# Altium schematic sheet SuperPower.SchDoc
size A4; Organization: Altium Limited; Address1: L3, 12a Rodborough Rd; Address2: Frenchs Forest; Address3: NSW; Address4: Australia 2086
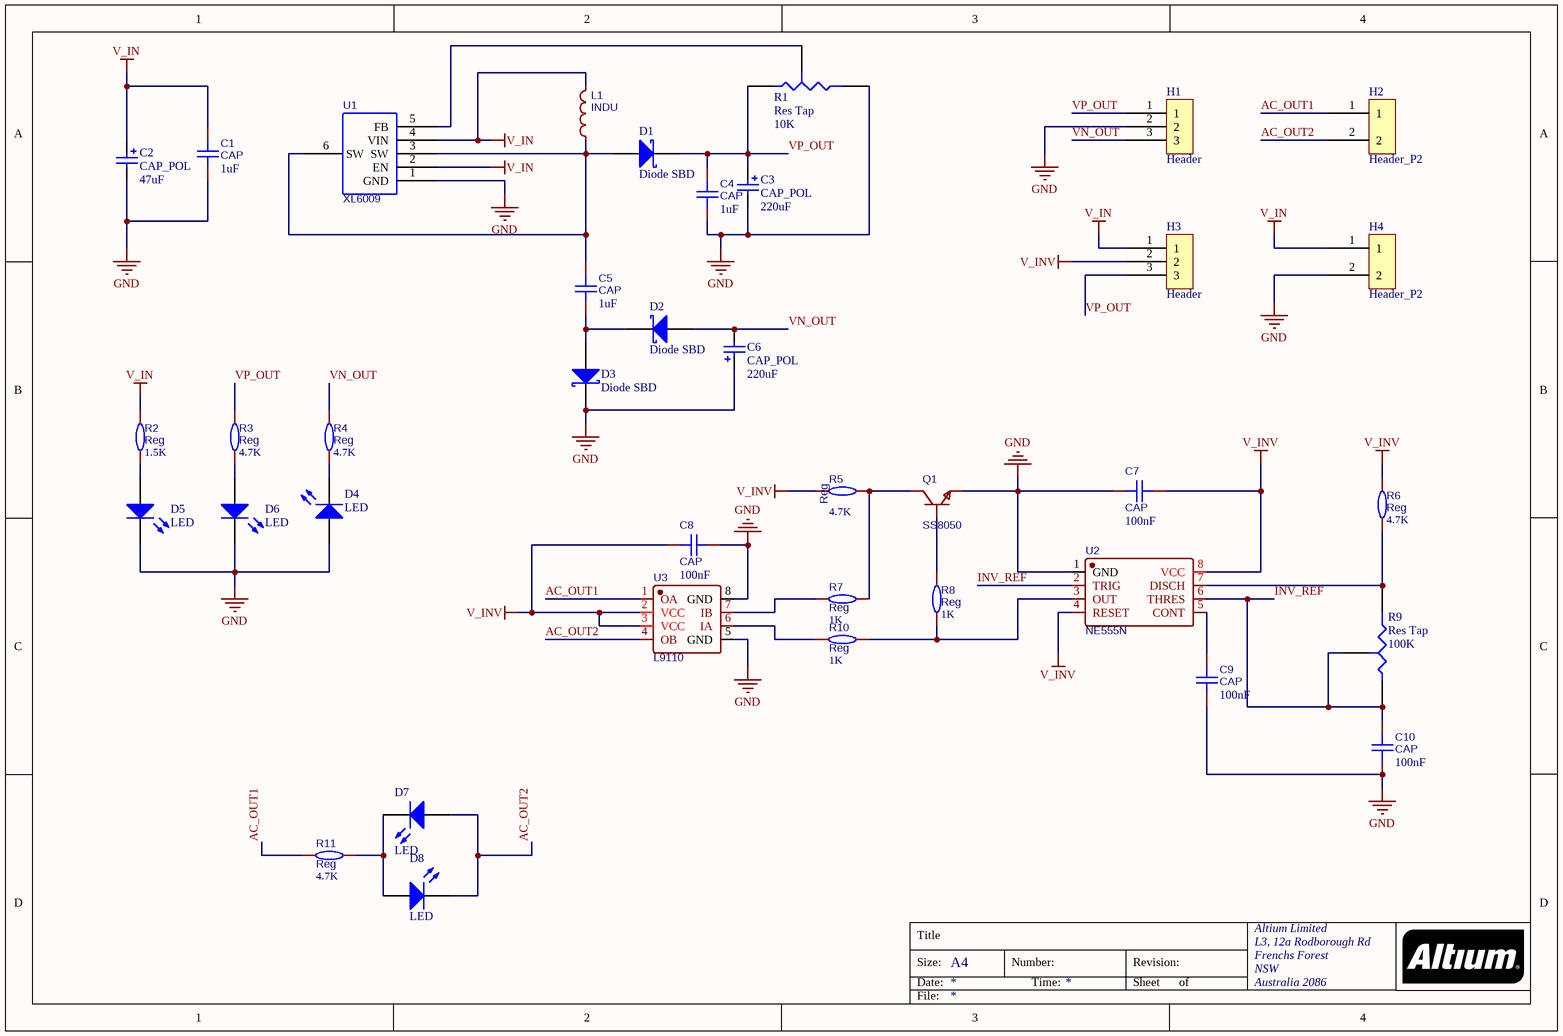
[diagram p0: SuperPower.SchDoc]

## Parts
C1  CAP  value 1uF  [C0603]
C2  CAP_POL  value 47uF  [CAP_SMD_10mm]
C3  CAP_POL  value 220uF  [CAP_SMD_10mm]
C4  CAP  value 1uF  [C0603]
C5  CAP  value 1uF  [C0603]
C6  CAP_POL  value 220uF  [CAP_SMD_10mm]
C7  CAP  value 100nF  [C0603]
C8  CAP  value 100nF  [C0603]
C9  CAP  value 100nF  [C0603]
C10  CAP  value 100nF  [C0603]
D1  Diode SBD  [SMA_L4.3]
D2  Diode SBD  [SMA_L4.3]
D3  Diode SBD  [SMA_L4.3]
D4  LED  [LED0603]
D5  LED  [LED0603]
D6  LED  [LED0603]
D7  LED  [LED0603]
D8  LED  [LED0603]
H1  Header  [H_2.54_P3]
H2  Header_P2  [H_2.54_P2]
H3  Header  [H_2.54_P3]
H4  Header_P2  [H_2.54_P2]
L1  INDU  [SMD_L7.1]
Q1  SS8050  [SOT-23-3]
R1  Res Tap  value 10K  [Res_Tap_3296]
R2  Reg  value 1.5K  [R0603]
R3  Reg  value 4.7K  [R0603]
R4  Reg  value 4.7K  [R0603]
R5  Reg  value 4.7K  [R0603]
R6  Reg  value 4.7K  [R0603]
R7  Reg  value 1K  [R0603]
R8  Reg  value 1K  [R0603]
R9  Res Tap  value 100K  [Res_Tap_3296]
R10  Reg  value 1K  [R0603]
R11  Reg  value 4.7K  [R0603]
U1  XL6009  [TO-263-5]
U2  NE555N  [DIP-8]
U3  L9110  [DIP-8]

## Nets
GND: C1.2 C2.2 C3.2 C4.2 C6.1 C7.1 C8.2 C9.2 C10.2 D3.1(K) D4.2(A) D5.1(K) D6.1(K) H1.2 H4.2 Q1.2(E) R1.2(B) U1.1(GND) U2.1(GND) U3.5(GND) U3.8(GND)
V_IN: C1.1 C2.1 H3.1 H4.1 L1.2 R2.1 U1.2(EN) U1.4(VIN)
V_INV: C7.2 C8.1 H3.2 R5.2 R6.2 U2.4(RESET) U2.8(VCC) U3.2(VCC) U3.3(VCC)
AC_OUT1: H2.1 R11.1 U3.1(OA)
AC_OUT2: D7.2(A) D8.1(K) H2.2 U3.4(OB)
INV_REF: C10.1 R9.1(A) R9.3(TAP) U2.2(TRIG) U2.6(THRES)
VN_OUT: C6.2 D2.2(A) H1.3 R4.1
VP_OUT: C3.1 C4.1 D1.1(K) H1.1 H3.3 R1.1(A) R3.1
NetC5_1: C5.1 D1.2(A) L1.1 U1.3(SW) U1.6(SW)
NetC5_2: C5.2 D2.1(K) D3.2(A)
NetC9_1: C9.1 U2.5(CONT)
NetD4_1: D4.1(K) R4.2
NetD5_2: D5.2(A) R2.2
NetD6_2: D6.2(A) R3.2
NetD7_1: D7.1(K) D8.2(A) R11.2
NetQ1_1: Q1.1(B) R8.2
NetQ1_3: Q1.3(C) R5.1 R7.2
NetR1_3: R1.3(TAP) U1.5(FB)
NetR6_1: R6.1 R9.2(B) U2.7(DISCH)
NetR7_1: R7.1 U3.7(IB)
NetR8_1: R8.1 R10.2 U2.3(OUT)
NetR10_1: R10.1 U3.6(IA)

## Notes on the sheet
- Title
- Size:
- Date:
- A4
- Number:
- Time:
- Revision:
- Sheet
- of
- File:

## Library data of the parts
C1 C4 C5 C7-C10 = CAP: BOM_Manufacturer: Huaxin S&T; BOM_Manufacturer Part: 0603B103K101CT; nameAlias: Capacitance; Contributor: LCSC; BOM_Supplier: LCSC; BOM_Supplier Part: C302008; spicePre: C; spiceSymbolName: 0603B103K101CT
C2 C3 C6 = CAP_POL: 极性电容
D1-D3 = Diode SBD: Schottky Rectifier; Note: Terminal 2 is the TAB and is electrically connected to the cathode; Published: 8-Jun-2000; LatestRevisionDate: 17-Jul-2002; LatestRevisionNote: Re-released for DXP Platform.; DatasheetVersion: PD-2.057B; PackageVersion: Feb-1998; PackageReference: TO-220AC; Publisher: Altium Limited; PackageDescription: TO, Thru-Hole, Vertical, Heatsink Mounted; 3 In-Line Leads (1 Absent); Pitch 2.54 mm; ComponentLink1Description: Manufacturer Link; ComponentLink1URL: http://www.irf.com/; ComponentLink2Description: Datasheet; ComponentLink2URL: http://www.irf.com/product-info/datasheets/data/10tq.pdf
D4-D8 = LED0: Published: 8-Jun-2000; LatestRevisionDate: 08-Jul-2005; LatestRevisionNote: Mech Layer 1 removed.; PackageReference: LED-0; Publisher: Altium Limited; PackageDescription: LED; 2 Leads
H1 H3 = Header_P3: 3Pin接口
H2 H4 = Header_P2: 2Pin排针
L1 = IND: 电感; BOM_Manufacturer: Sunltech Tech; BOM_Manufacturer Part: SLO0630H150MTT; nameAlias: Inductance; Contributor: LCSC; BOM_Supplier: LCSC; BOM_Supplier Part: C182182; BOM_JLCPCB Part Class: Extended Part; spicePre: L; spiceSymbolName: SLO0630H150MTT; Value: *
Q1 = SS8050: NPN; BOM_Manufacturer: AnBon; Contributor: LCSC; BOM_Paste Type: recommend; BOM_Supplier: LCSC; BOM_Supplier Part: C541705; BOM_Manufacturer Part: SS8050; spicePre: Q; spiceSymbolName: SS8050_C541705
R1 R9 = Res Tap: 可调电阻; Sim Note: Enter the Resistance value and the set point into parameter fields.; Set Position: 0.5; Published: 24-Mar-1999; LatestRevisionDate: 17-Jul-2002; LatestRevisionNote: Re-released for DXP Platform.; PackageReference: VR3; Publisher: Altium Limited; PackageDescription: Variable Resistor, Thru-Hole; 3 Leads
R2-R8 R10 R11 = Res: 电阻; BOM_Manufacturer: Viking Tech; BOM_Manufacturer Part: AR03BTCX1002A; nameAlias: Resistance (Ohms); Contributor: LCSC; BOM_Supplier: LCSC; BOM_Supplier Part: C465721; spicePre: R; spiceSymbolName: AR03BTCX1002A
U1 = XL6009: BOM_Manufacturer: TI; BOM_Manufacturer Part: LM2577SX-ADJ/NOPB; BOM_Supplier: LCSC; BOM_Supplier Part: C17117; BOM_JLCPCB Part Class: Extended Part; spicePre: U; spiceSymbolName: LM2577SX-ADJ/NOPB
U2 = NE555N: NE555_IC; BOM_Manufacturer: HGSEMI; Contributor: LCSC; BOM_Supplier: LCSC; BOM_Supplier Part: C398063; BOM_Manufacturer Part: NE555N; BOM_JLCPCB Part Class: Extended Part; spicePre: U; spiceSymbolName: NE555N
U3 = L9110: L9110_HBridge; BOM_Manufacturer: Mixic; BOM_Manufacturer Part: L9110S; Contributor: LCSC; BOM_Supplier: LCSC; BOM_Supplier Part: C513306; BOM_JLCPCB Part Class: Extended Part; spicePre: U; spiceSymbolName: L9110S_C513306